# EAGLE schematic Works_003 (EAGLE 8.2.1)
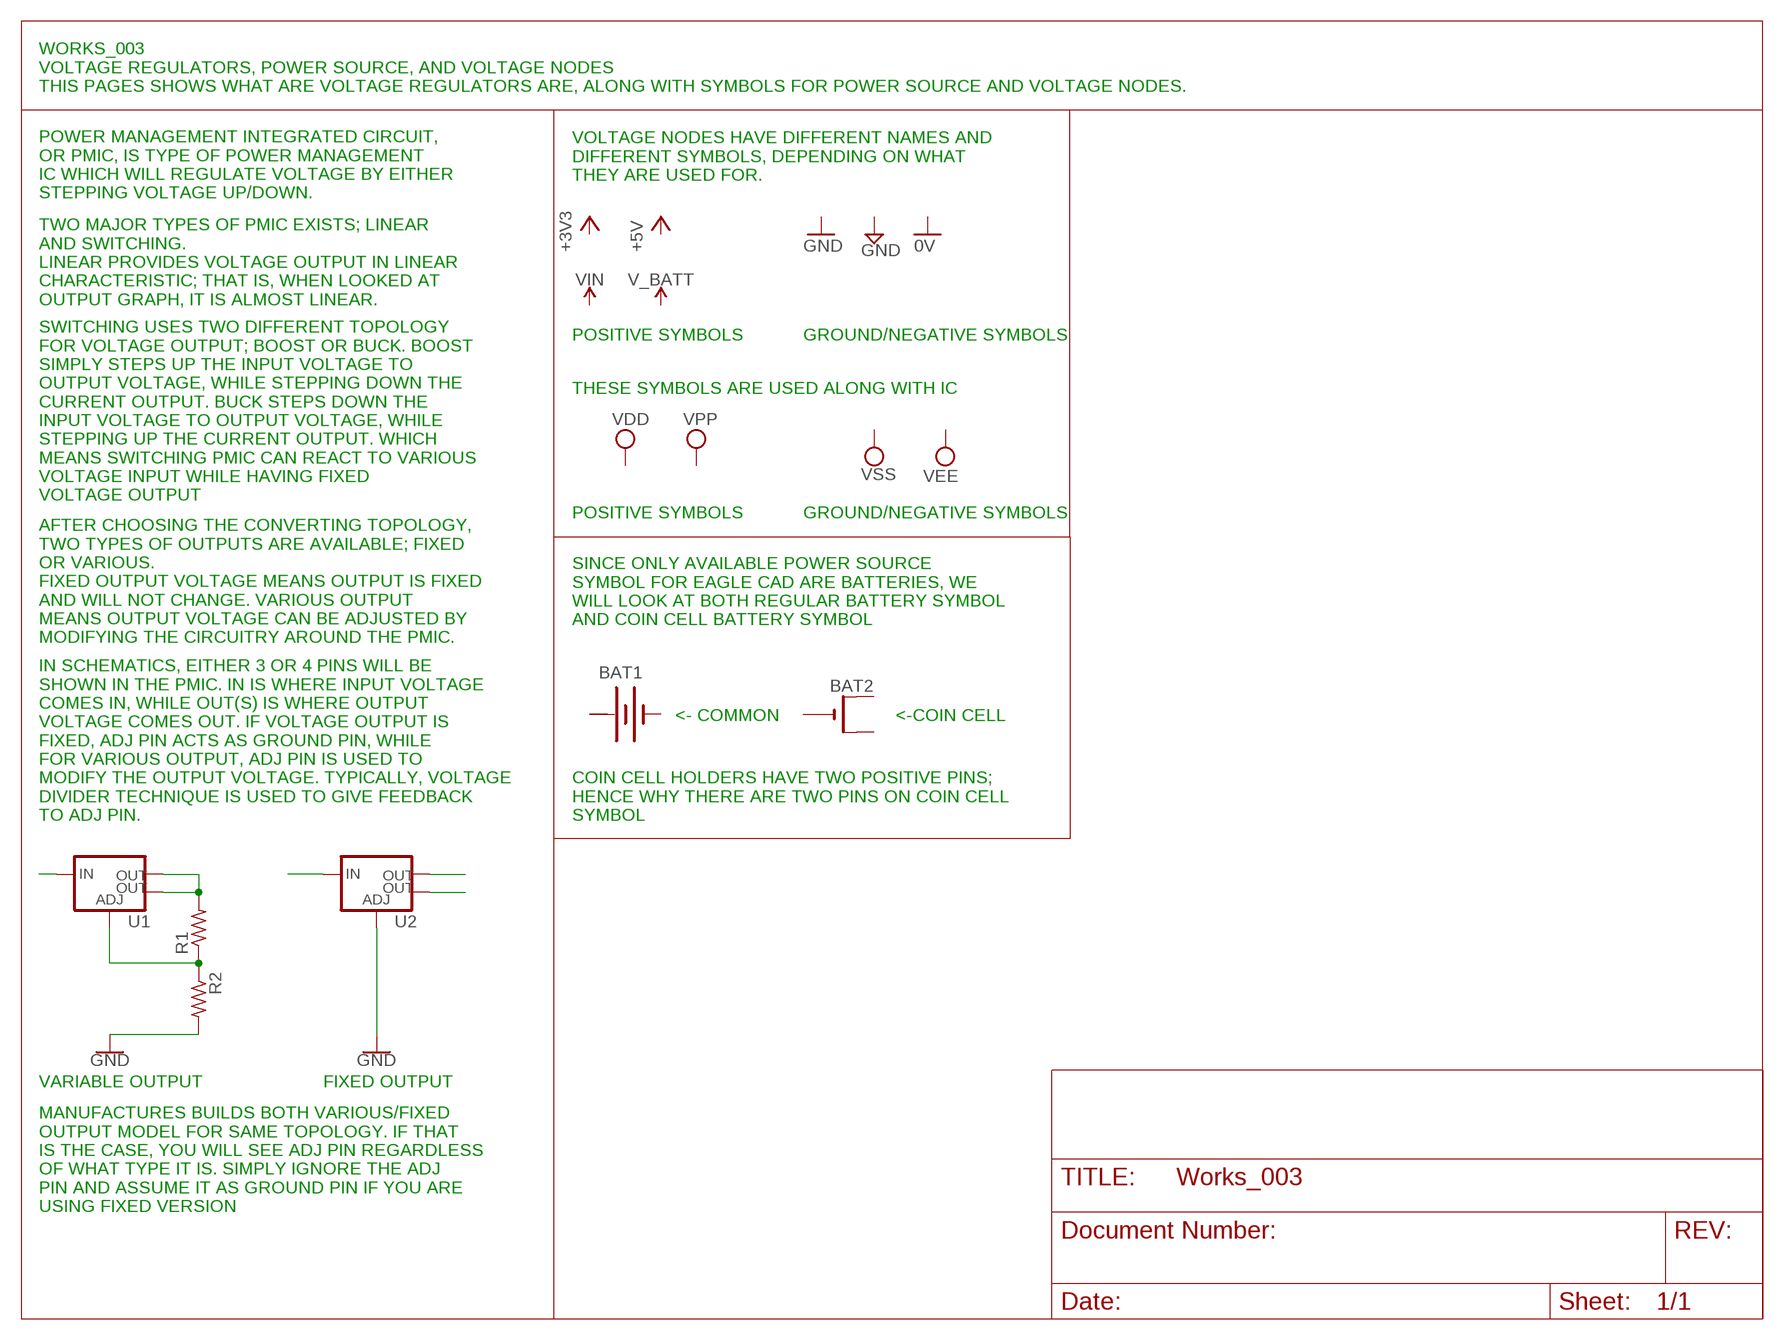
[diagram p0: schematic, sheet 1]

## Parts
BAT1  BATTERY  [BATTERY]
BAT2  CR1220SMT  [CR1220-SMD]
R1  R-US_R0805  [R0805]
R2  R-US_R0805  [R0805]
U1  V_REG_LM1117SOT223  [SOT223]
U2  V_REG_LM1117SOT223  [SOT223]

## Nets
GND: R2.2 U2.1(ADJ)
N$1: U2.2(OUT)
N$2: R1.2 U1.2(OUT) U1.4(OUT)
N$3: R1.1 R2.1 U1.1(ADJ)
N$4: U2.4(OUT)
N$5: U2.3(IN)
N$6: U1.3(IN)
Unconnected: BAT2.+$1(+) BAT2.+$2(+1) BAT2.-

## Notes on the sheet
- WORKS_003
  VOLTAGE REGULATORS, POWER SOURCE, AND VOLTAGE NODES
  THIS PAGES SHOWS WHAT ARE VOLTAGE REGULATORS ARE, ALONG WITH SYMBOLS FOR POWER SOURCE AND VOLTAGE NODES.
- VOLTAGE NODES HAVE DIFFERENT NAMES AND
  DIFFERENT SYMBOLS, DEPENDING ON WHAT
  THEY ARE USED FOR.
- POWER MANAGEMENT INTEGRATED CIRCUIT,
  OR PMIC, IS TYPE OF POWER MANAGEMENT
  IC WHICH WILL REGULATE VOLTAGE BY EITHER
  STEPPING VOLTAGE UP/DOWN.
- TWO MAJOR TYPES OF PMIC EXISTS; LINEAR
  AND SWITCHING.
  LINEAR PROVIDES VOLTAGE OUTPUT IN LINEAR
  CHARACTERISTIC; THAT IS, WHEN LOOKED AT
  OUTPUT GRAPH, IT IS ALMOST LINEAR.
- POSITIVE SYMBOLS | GROUND/NEGATIVE SYMBOLS
- THESE SYMBOLS ARE USED ALONG WITH IC
- SWITCHING USES TWO DIFFERENT TOPOLOGY
  FOR VOLTAGE OUTPUT; BOOST OR BUCK. BOOST
  SIMPLY STEPS UP THE INPUT VOLTAGE TO
  OUTPUT VOLTAGE, WHILE STEPPING DOWN THE
  CURRENT OUTPUT. BUCK STEPS DOWN THE
  INPUT VOLTAGE TO OUTPUT VOLTAGE, WHILE
  STEPPING UP THE CURRENT OUTPUT. WHICH
  MEANS SWITCHING PMIC CAN REACT TO VARIOUS 
  VOLTAGE INPUT WHILE HAVING FIXED
  VOLTAGE OUTPUT
- POSITIVE SYMBOLS | GROUND/NEGATIVE SYMBOLS
- SINCE ONLY AVAILABLE POWER SOURCE
  SYMBOL FOR EAGLE CAD ARE BATTERIES, WE
  WILL LOOK AT BOTH REGULAR BATTERY SYMBOL
  AND COIN CELL BATTERY SYMBOL
- AFTER CHOOSING THE CONVERTING TOPOLOGY,
  TWO TYPES OF OUTPUTS ARE AVAILABLE; FIXED
  OR VARIOUS.
  FIXED OUTPUT VOLTAGE MEANS OUTPUT IS FIXED
  AND WILL NOT CHANGE. VARIOUS OUTPUT
  MEANS OUTPUT VOLTAGE CAN BE ADJUSTED BY
  MODIFYING THE CIRCUITRY AROUND THE PMIC.
- <- COMMON | <-COIN CELL
- IN SCHEMATICS, EITHER 3 OR 4 PINS WILL BE
  SHOWN IN THE PMIC. IN IS WHERE INPUT VOLTAGE
  COMES IN, WHILE OUT(S) IS WHERE OUTPUT
  VOLTAGE COMES OUT. IF VOLTAGE OUTPUT IS
  FIXED, ADJ PIN ACTS AS GROUND PIN, WHILE
  FOR VARIOUS OUTPUT, ADJ PIN IS USED TO
  MODIFY THE OUTPUT VOLTAGE. TYPICALLY, VOLTAGE
  DIVIDER TECHNIQUE IS USED TO GIVE FEEDBACK
  TO ADJ PIN.
- COIN CELL HOLDERS HAVE TWO POSITIVE PINS;
  HENCE WHY THERE ARE TWO PINS ON COIN CELL
  SYMBOL
- VARIABLE OUTPUT | FIXED OUTPUT
- MANUFACTURES BUILDS BOTH VARIOUS/FIXED
  OUTPUT MODEL FOR SAME TOPOLOGY. IF THAT
  IS THE CASE, YOU WILL SEE ADJ PIN REGARDLESS
  OF WHAT TYPE IT IS. SIMPLY IGNORE THE ADJ
  PIN AND ASSUME IT AS GROUND PIN IF YOU ARE
  USING FIXED VERSION

## Power pins joined to a net without a drawn wire
+: BAT1.+ BAT1.+@1(+)
-: BAT1.-

## Library data of the parts
BAT1 = special:BATTERY: BATTERY
BAT2 = adafruit:CR1220: CR1216/CR1220/CR1225 12mm 3V lithium coin cell Great for battery packup. Both SMT and THM holders. Note the THM package has the ground pads on both sides of the PCB so that the masks are the same - this reduces the cost
R1 R2 = adafruit:R-US_: RESISTOR, American symbol
U1 U2 = SparkFun-IC-Power:V_REG_LM1117: Voltage Regulator LM1117 Standard adjustable voltage regulator but in SMD form. Spark Fun Electronics SKU : COM-00595; PROD_ID: VREG-08170